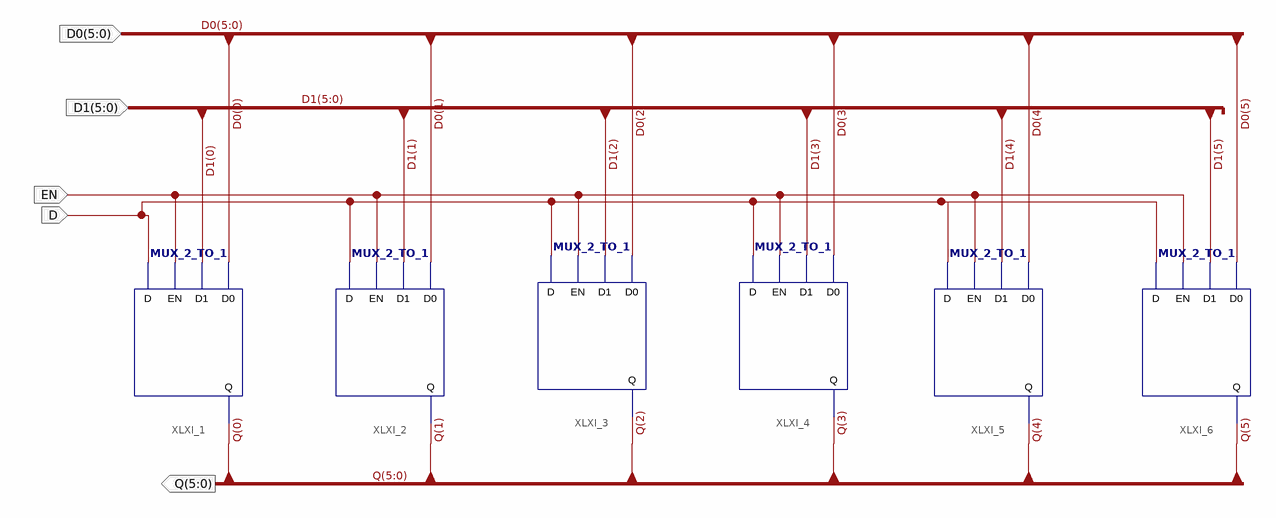
[diagram p0: schematic sheet 1]
// Xilinx ISE schematic MUX_2WAY_6BIT.sch (spartan3e) as structural Verilog: 6 symbols, 5 ports
module MUX_2WAY_6BIT (
  input  D,
  input  EN,
  input  [5:0] D0,
  input  [5:0] D1,
  output [5:0] Q
);

  MUX_2_TO_1 XLXI_1 (.D(D), .D0(D0[0]), .D1(D1[0]), .EN(EN), .Q(Q[0]));
  MUX_2_TO_1 XLXI_2 (.D(D), .D0(D0[1]), .D1(D1[1]), .EN(EN), .Q(Q[1]));
  MUX_2_TO_1 XLXI_3 (.D(D), .D0(D0[2]), .D1(D1[2]), .EN(EN), .Q(Q[2]));
  MUX_2_TO_1 XLXI_4 (.D(D), .D0(D0[3]), .D1(D1[3]), .EN(EN), .Q(Q[3]));
  MUX_2_TO_1 XLXI_5 (.D(D), .D0(D0[4]), .D1(D1[4]), .EN(EN), .Q(Q[4]));
  MUX_2_TO_1 XLXI_6 (.D(D), .D0(D0[5]), .D1(D1[5]), .EN(EN), .Q(Q[5]));
endmodule
